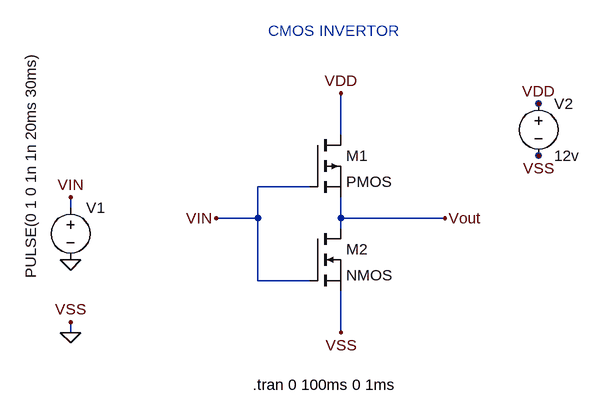
[diagram p0: schematic CMOS INVERTER.asc]
CMOS INVERTER.asc, the LTspice schematic file:
Version 4.1
SHEET 1 880 680
WIRE 208 64 208 0
WIRE 160 144 80 144
WIRE -208 176 -208 160
WIRE 80 192 80 144
WIRE 80 192 16 192
WIRE 208 192 208 160
WIRE 368 192 208 192
WIRE 208 208 208 192
WIRE 80 288 80 192
WIRE 160 288 80 288
WIRE -208 368 -208 352
WIRE 208 368 208 304
WIRE 512 16 512 16
WIRE 512 96 512 96
FLAG 368 192 Vout
FLAG -208 256 0
FLAG -208 160 VIN
FLAG 16 192 VIN
FLAG 512 16 VDD
FLAG 208 0 VDD
FLAG 512 96 VSS
FLAG 208 368 VSS
FLAG -208 368 0
FLAG -208 352 VSS
SYMBOL pmos 160 64 R0
SYMATTR InstName M1
SYMBOL nmos 160 208 R0
SYMATTR InstName M2
SYMBOL voltage -208 160 R0
WINDOW 3 -61 -223 VRight 2
WINDOW 123 0 0 Left 0
WINDOW 39 0 0 Left 0
SYMATTR Value PULSE(0 1 0 1n 1n 20ms 30ms)
SYMATTR InstName V1
SYMBOL voltage 512 0 R0
SYMATTR InstName V2
SYMATTR Value 12v
TEXT 72 448 Left 2 !.tran 0 100ms 0 1ms
TEXT 96 -96 Left 2 ;CMOS INVERTOR

The netlist it stands for:
* CMOS INVERTER.asc
M1 VDD VIN Vout Vout PMOS
M2 Vout VIN 0 0 NMOS
V1 VIN 0 PULSE(0 1 0 1n 1n 20ms 30ms)
V2 VDD 0 12v
.model NMOS NMOS
.model PMOS PMOS
.lib standard.mos
.tran 0 100ms 0 1ms
* CMOS INVERTOR
.backanno
.end